# Altium project Olimex interface board.PrjPcb
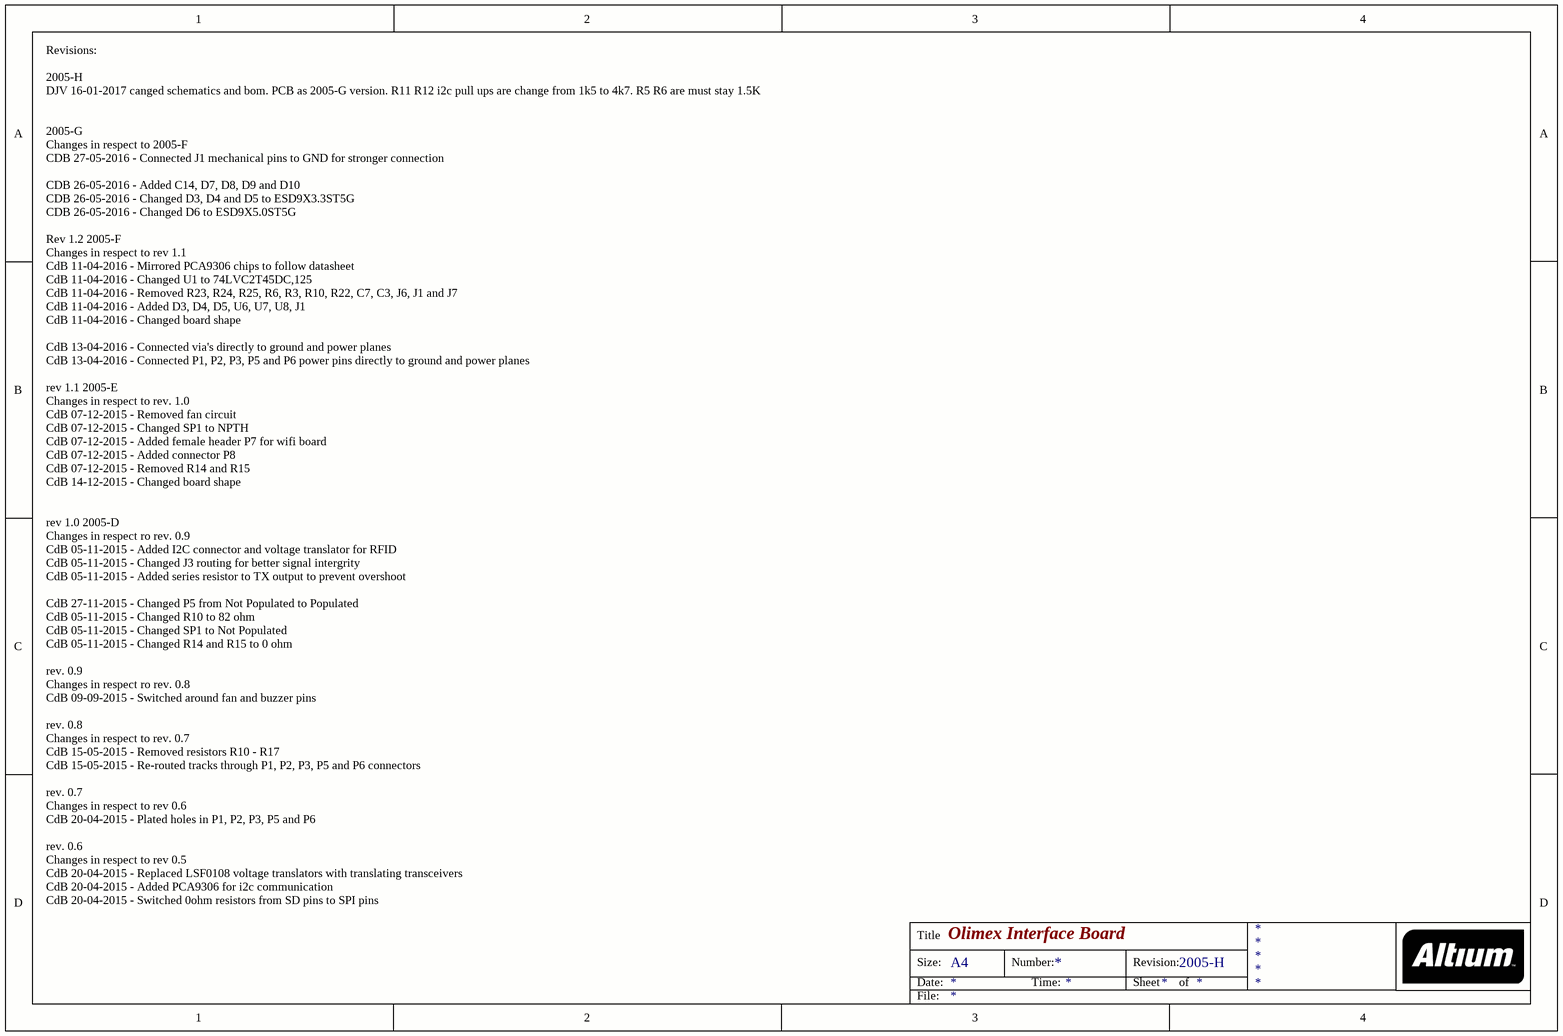
[diagram p0: Revisions.SchDoc]
3 sheets, 92 parts. Net scope: flat (ports and power ports of the same name join across sheets).
Board file: Olimex interface board.PcbDoc
Sheets:
  Revisions.SchDoc
  Schema1.SchDoc
  Schema2.SchDoc

## Sheet Revisions.SchDoc: Olimex Interface Board
size A4; CompanyName: Ultimaker B.V.; DrawnBy: Coen de Boer; Engineer: Coen de Boer; Revision: 2005-H

### Notes on the sheet
- Revisions:
  2005-H
  DJV 16-01-2017 canged schematics and bom. PCB as 2005-G version. R11 R12 i2c pull ups are change from 1k5 to 4k7. R5 R6 are must stay 1.5K
  2005-G
  Changes in respect to 2005-F
  CDB 27-05-2016 - Connected J1 mechanical pins to GND for stronger connection
  CDB 26-05-2016 - Added C14, D7, D8, D9 and D10
  CDB 26-05-2016 - Changed D3, D4 and D5 to ESD9X3.3ST5G
  CDB 26-05-2016 - Changed D6 to ESD9X5.0ST5G
  Rev 1.2 2005-F
  Changes in respect to rev 1.1
  CdB 11-04-2016 - Mirrored PCA9306 chips to follow datasheet
  CdB 11-04-2016 - Changed U1 to 74LVC2T45DC,125
  CdB 11-04-2016 - Removed R23, R24, R25, R6, R3, R10, R22, C7, C3, J6, J1 and J7
  CdB 11-04-2016 - Added D3, D4, D5, U6, U7, U8, J1
  CdB 11-04-2016 - Changed board shape
  CdB 13-04-2016 - Connected via's directly to ground and power planes
  CdB 13-04-2016 - Connected P1, P2, P3, P5 and P6 power pins directly to ground and power planes
  rev 1.1 2005-E
  Changes in respect to rev. 1.0
  CdB 07-12-2015 - Removed fan circuit
  CdB 07-12-2015 - Changed SP1 to NPTH
  CdB 07-12-2015 - Added female header P7 for wifi board
  CdB 07-12-2015 - Added connector P8
  CdB 07-12-2015 - Removed R14 and R15
  CdB 14-12-2015 - Changed board shape
  rev 1.0 2005-D
  Changes in respect ro rev. 0.9
  CdB 05-11-2015 - Added I2C connector and voltage translator for RFID
  CdB 05-11-2015 - Changed J3 routing for better signal intergrity
  CdB 05-11-2015 - Added series resistor to TX output to prevent overshoot
  CdB 27-11-2015 - Changed P5 from Not Populated to Populated
  CdB 05-11-2015 - Changed R10 to 82 ohm
  CdB 05-11-2015 - Changed SP1 to Not Populated
  CdB 05-11-2015 - Changed R14 and R15 to 0 ohm
  rev. 0.9
  Changes in respect ro rev. 0.8
  CdB 09-09-2015 - Switched around fan and buzzer pins
  rev. 0.8
  Changes in respect to rev. 0.7
  CdB 15-05-2015 - Removed resistors R10 - R17
  CdB 15-05-2015 - Re-routed tracks through P1, P2, P3, P5 and P6 connectors
  rev. 0.7
  Changes in respect to rev 0.6
  CdB 20-04-2015 - Plated holes in P1, P2, P3, P5 and P6
  rev. 0.6
  Changes in respect to rev 0.5
  CdB 20-04-2015 - Replaced LSF0108 voltage translators with translating transceivers
  CdB 20-04-2015 - Added PCA9306 for i2c communication
  CdB 20-04-2015 - Switched 0ohm resistors from SD pins to SPI pins
  CdB 20-04-2015 - Added resistors in series to non used pins to Ulticontroller
  CdB 20-04-2015 - Moved SD-card detect to interrupt pin
- Title
- Size:
- Date:
- A4
- Number:
- Time:
- Revision:
- Sheet
- of
- File:

## Sheet Schema1.SchDoc: Olimex interface board
size A4; DrawnBy: Coen de Boer; Engineer: Coen de Boer; Revision: 2005-H; SheetNumber: 1
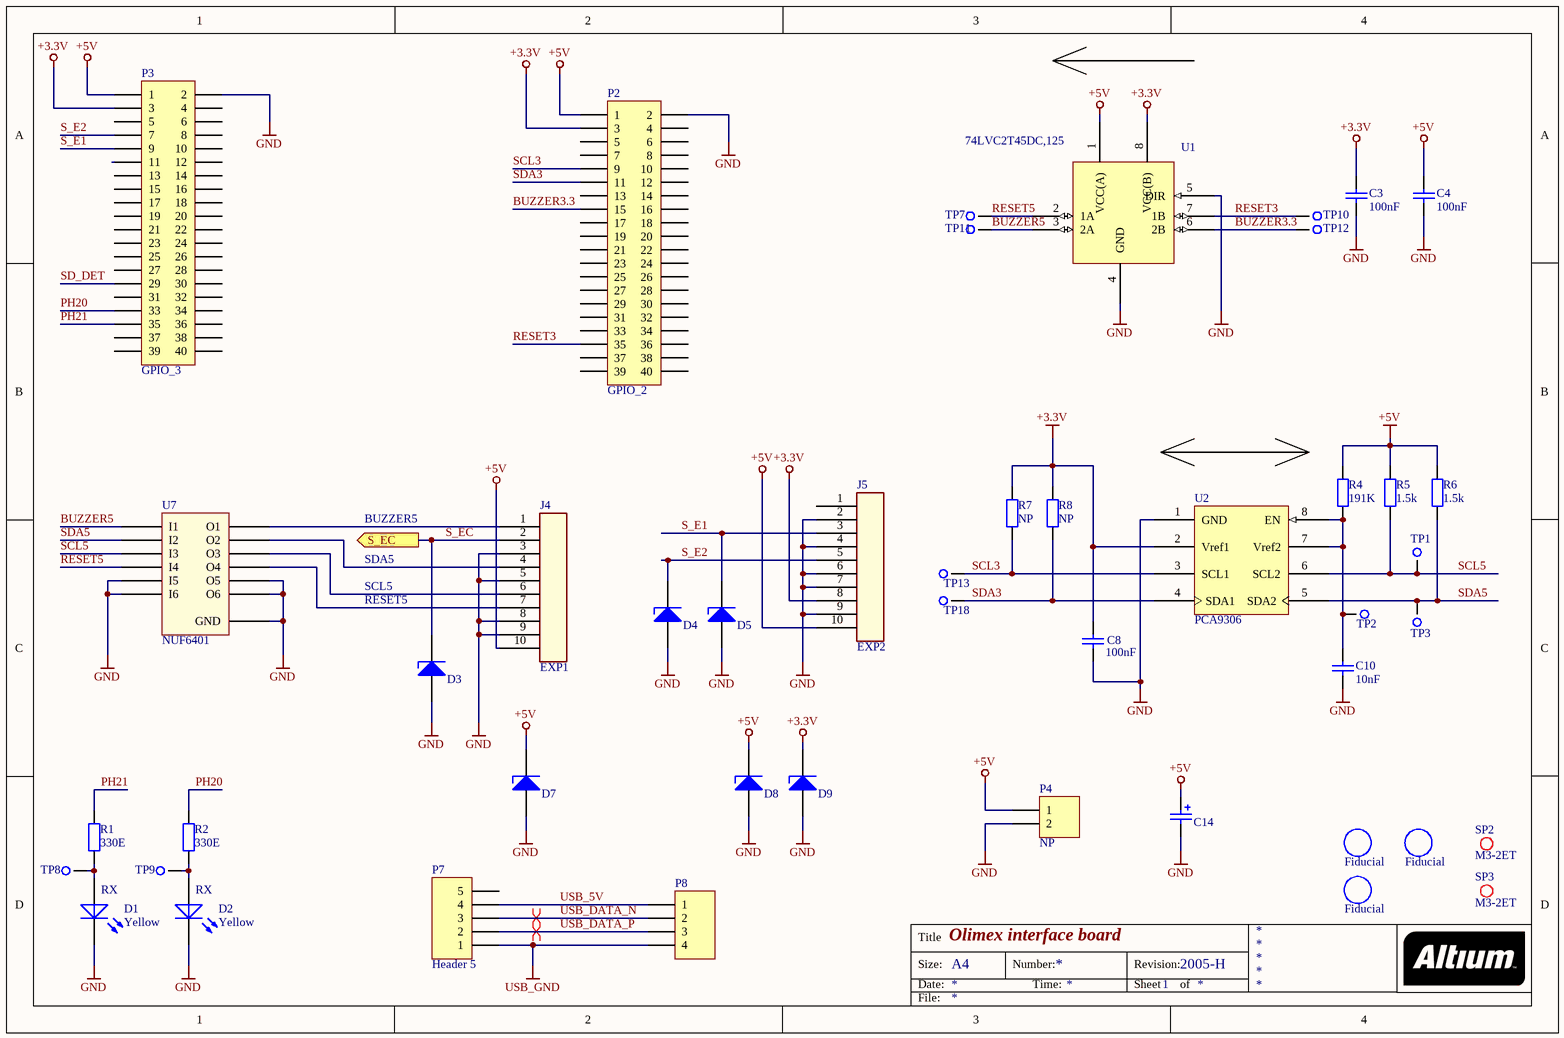
[diagram p1: Schema1.SchDoc]

### Parts
C3  100nF  [C0805 (2012)]
C4  100nF  [C0805 (2012)]
C8  100nF  [C0805 (2012)]
C10  10nF  [C0805 (2012)]
C14  470u  [CAPAE7866X80M]  (value not drawn)
D1  Yellow  [LED0805-YELLOW]
D2  Yellow  [LED0805-YELLOW]
D3  ESD9X3.3ST5G  [SODFL100X40-2N]  (value not drawn)
D4  ESD9X3.3ST5G  [SODFL100X40-2N]  (value not drawn)
D5  ESD9X3.3ST5G  [SODFL100X40-2N]  (value not drawn)
D7  ESD9X5.0ST5G  [SODFL100X40-2N]  (value not drawn)
D8  ESD9X5.0ST5G  [SODFL100X40-2N]  (value not drawn)
D9  ESD9X3.3ST5G  [SODFL100X40-2N]  (value not drawn)
Fid1  Fiducial  [Fiducial 1,5mm]  (no BOM)
Fid2  Fiducial  [Fiducial 1,5mm]  (no BOM)
Fid3  Fiducial  [Fiducial 1,5mm]  (no BOM)
J4  EXP1  [BOXHEADER-10P-R/A-ST-2.54]
J5  EXP2  [BOXHEADER-10P-R/A-ST-2.54]
P2  GPIO_2  [M50-3152042]
P3  GPIO_3  [M50-3152042]
P4  NP  [HDR1X2]
P7  Header 5  [Female Header 5 pins]
P8  (no value)  [B4B-XH-A]
R1  330E  [RESC1608X05N]
R2  330E  [RESC1608X05N]
R4  191K  [R0805 (2012)]
R5  1.5k  [RESC1608X05N]
R6  1.5k  [RESC1608X05N]
R7  NP  [R0805 (2012)]
R8  NP  [R0805 (2012)]
SP2  M3-2ET  [SPACER M3-4ET]
SP3  M3-2ET  [Spacer M3-4ETkleinepad]
TP1  2mm  [TESTPOINT 2mm]  (value not drawn)  (no BOM)
TP2  2mm  [TESTPOINT 2mm]  (value not drawn)  (no BOM)
TP3  2mm  [TESTPOINT 2mm]  (value not drawn)  (no BOM)
TP7  2mm  [TESTPOINT 2mm]  (value not drawn)  (no BOM)
TP8  2mm  [TESTPOINT 2mm]  (value not drawn)  (no BOM)
TP9  2mm  [TESTPOINT 2mm]  (value not drawn)  (no BOM)
TP10  2mm  [TESTPOINT 2mm]  (value not drawn)  (no BOM)
TP11  2mm  [TESTPOINT 2mm]  (value not drawn)  (no BOM)
TP12  2mm  [TESTPOINT 2mm]  (value not drawn)  (no BOM)
TP13  2mm  [TESTPOINT 2mm]  (value not drawn)  (no BOM)
TP18  2mm  [TESTPOINT 2mm]  (value not drawn)  (no BOM)
U1  74LVC2T45DC,125  [TSSOP50P310X100-8N]
U2  PCA9306  [IC SSOP-8]
U7  NUF6401  [SON50P140X100_HS-13N]

### Ports
S_EC (out)

### Nets
+3.3V: C3.1 C8.2 D9.1(K) J5.8 P2.3 P3.3 R7.2 R8.2 U1.8(VCC(B)) U2.2(Vref1)
+5V: C4.1 C14.1 D7.1(K) D8.1(K) J4.10 J5.10 P2.1 P3.1 P4.1 R4.2 R5.2 R6.2 U1.1(VCC(A))
GND: C3.2 C4.2 C8.1 C10.1 C14.2 D1.2(K) D2.2(K) D3.2(A) D4.2(A) D5.2(A) D7.2(A) D8.2(A) D9.2(A) J4.3 J4.5 J4.8 J4.9 J5.2 J5.4 J5.6 J5.7 J5.9 P2.2 P3.2 P4.2 U1.4(GND) U1.5(DIR) U2.1(GND) U7.5(I5) U7.6(I6) U7.7(O6) U7.8(O5) U7.13(GND)
USB_GND: P7.1 P8.4
BUZZER3.3: P2.15 TP12.1 U1.6(2B)
BUZZER5: TP11.1 U1.3(2A) U7.1(I1)
PH20: P3.33 R2.2
PH21: P3.35 R1.2
RESET3: P2.35 TP10.1 U1.7(1B)
RESET5: TP7.1 U1.2(1A) U7.4(I4)
S_E1: D5.1(K) J5.3 P3.9
S_E2: D4.1(K) J5.5 P3.7
S_EC: D3.1(K) J4.2 ; port S_EC
SCL3: P2.9 R7.1 TP13.1 U2.3(SCL1)
SCL5: R5.1 TP1.1 U2.6(SCL2) U7.3(I3)
SD_DET: P3.29
SDA3: P2.11 R8.1 TP18.1 U2.4(SDA1)
SDA5: R6.1 TP3.1 U2.5(SDA2) U7.2(I2)
USB_5V: P7.4 P8.1
USB_DATA_N: P7.3 P8.2
USB_DATA_P: P7.2 P8.3
NetC10_2: C10.2 R4.1 TP2.1 U2.7(Vref2) U2.8(EN)
NetD1_1: D1.1(A) R1.1 TP8.1
NetD2_1: D2.1(A) R2.1 TP9.1
NetJ4_1: J4.1 U7.12(O1)
NetJ4_4: J4.4 U7.11(O2)
NetJ4_6: J4.6 U7.10(O3)
NetJ4_7: J4.7 U7.9(O4)

Not connected (* = marked no-connect by the designer): J5 1; P2 4 5 6 7 8 10 12 13 14 16 17 18 19 20 21 22 23 24 25 26 27 28 29 30 31 32 33 34 36 37 38 39 40; P3 4 5 6 8 10 11 12 13 14 15 16 17 18 19 20 21 22 23 24 25 26 27 28 30 31 32 34 36 37 38 39 40; P7 5

### Layout directives
differential pair: USB_DATA_N, USB_DATA_P

### Notes on the sheet
- BUZZER5
- SDA5
- SCL5
- RESET5
- (near D1) RX
- (near D2) RX
- Title
- Size:
- Date:
- A4
- Number:
- Time:
- Revision:
- Sheet
- of
- File:

### Library data of the parts
C3 C4 C8 = Cap 100nF X7R 0805: Cap 100nF X7R 0805 10% 100V; Mfg: AVX; Mfg code: 08051C104K4T2A; Faber ItemCode: -; Max soldering temp: -; Remarks: -; Supplier: Farnell; Supplier code: 1833888; Value: 100nF; SMD: Yes
C10 = Cap 10nF X7R 0805: Cap 10nF X7R 0805 10% 100V; Mfg: AVX; Mfg code: 08051C103K4Z2A; Faber ItemCode: -; Max soldering temp: -; Remarks: -; Supplier: Farnell; Supplier code: 1833850; SMD: Yes; Value: 10nF
C14 = CAP ALUM 470UF 20% 10V SMD: Mfg: Panasonic Electronic Components; Mfg code: EEE-FTA471XAP; Capacitance: 470µF; ESR (Equivalent Series Resistance): 160 mohm @ 100kHz; Lifetime @ Temp.: 2000 Hrs @ 105°C; Polarization: Polar; Ripple Current: 390mA @ 120Hz; Surface Mount Land Size: 0.260" L x 0.260" W (6.60mm x 6.60mm); Supplier 1: Digi-Key; Supplier Part Number 1: P15094TR-ND; RoHS: RoHS Compliant; Category: Capacitors; Stock: 31500; Pricing: 900=0.22154, 1800=0.20851, 2700=0.19548, 4500=0.18244, 9000=0.17593, 22500=0.17332, 45000=0.16941, 90000=0.16615 (EUR); Packaging: Tape & Reel (TR); Tolerance: ±20%; Voltage Rating: 10V; Operating Temperature: -55°C ~ 105°C; Applications: General Purpose; Impedance: -; Lead Spacing: -; Size / Dimension: 0.248" Dia (6.30mm); Height - Seated (Max): 0.315" (8.00mm); Mounting Type: Surface Mount; Package / Case: Radial, Can - SMD; ComponentLink1URL: http://industrial.panasonic.com/cdbs/www-data/pdf/RDE0000/ABA0000C35.pdf; ComponentLink1Description: http://industrial.panasonic.com/cdbs/www-data/pdf/RDE0000/ABA0000C35.pdf
D1 D2 = Library_LED-0003: RO LED GEEL HSMY-C170 0805  AVAGO; Faber ItemCode: 35160800; ID: Library_LED-0003; Mfg: AVAGO; Mfg code: HSMY-C170; Value: Yellow
D3-D5 D9 = ESD9X3.3ST5G: TVS DIODE 3.3VWM 10.4VC SOD923; Mfg: ON Semiconductor; Type: Zener; Unidirectional Channels: 1; Voltage - Reverse Standoff (Typ): 3.3V (Max); Voltage - Breakdown (Min): 5V; Voltage - Clamping (Max) @ Ipp: 10.4V; Current - Peak Pulse (10/1000µs): 9.8A (8/20µs); Power - Peak Pulse: 102W; Power Line Protection: No; Capacitance @ Frequency: 80pF @ 1MHz; Supplier 1: Digi-Key; Supplier Part Number 1: ESD9X3.3ST5GOSTR-ND; Mfg code: ESD9X3.3ST5G; RoHS: RoHS Compliant; Category: Circuit Protection; Stock: 136000; Pricing: 8000=0.03287, 16000=0.02794, 24000=0.02629, 56000=0.02465, 200000=0.02136 (EUR); Packaging: Tape & Reel (TR); Bidirectional Channels: -; Applications: Automotive; Operating Temperature: -55°C ~ 150°C (TJ); Mounting Type: Surface Mount; Package / Case: SOD-923; Supplier Device Package: SOD-923; ComponentLink1URL: http://www.onsemi.com/pub_link/Collateral/ESD9X3.3ST5G-D.PDF; ComponentLink1Description: http://www.onsemi.com/pub_link/Collateral/ESD9X3.3ST5G-D.PDF
D7 D8 = ESD9X5.0ST5G: TVS DIODE 5VWM 12.3VC SOD923; Mfg: ON Semiconductor; Type: Zener; Unidirectional Channels: 1; Voltage - Reverse Standoff (Typ): 5V (Max); Voltage - Breakdown (Min): 6.2V; Voltage - Clamping (Max) @ Ipp: 12.3V; Current - Peak Pulse (10/1000µs): 8.7A (8/20µs); Power - Peak Pulse: 107W; Power Line Protection: No; Capacitance @ Frequency: 65pF @ 1MHz; Supplier 1: Digi-Key; Supplier Part Number 1: ESD9X5.0ST5GOSTR-ND; Mfg code: ESD9X5.0ST5G; RoHS: RoHS Compliant; Category: Circuit Protection; Stock: 40000; Pricing: 8000=0.02337, 16000=0.02032, 24000=0.01829, 56000=0.01626, 200000=0.01351 (EUR); Packaging: Tape & Reel (TR); Bidirectional Channels: -; Applications: General Purpose; Operating Temperature: -55°C ~ 150°C (TJ); Mounting Type: Surface Mount; Package / Case: SOD-923; Supplier Device Package: SOD-923; ComponentLink1URL: http://www.onsemi.com/pub_link/Collateral/ESD9X3.3ST5G-D.PDF; ComponentLink1Description: http://www.onsemi.com/pub_link/Collateral/ESD9X3.3ST5G-D.PDF
Fid1-Fid3 = Library_MISC-0003: ID: Library_MISC-0003; Faber ItemCode: -; Mfg: -; Mfg code: -; Value: Fiducial
J4 J5 = Library_CON-0019: RO CONN PR HDR BOX 10p HKS 61201021721 WUERTH; Value: BOXHEADER-10P-R/A-ST-2.54; Faber ItemCode: 36925800; ID: Library_CON-0019
P2 P3 = MHDR2X20: HARWIN - M50-3152042 - SOCKET, DUAL ENTRY, SMT, 40WAY; LatestRevisionDate: 17-Jul-2002; LatestRevisionNote: Re-released for DXP Platform.; Publisher: Altium Limited; Farnell code:: 1189109; Mfg: Harwin; Mfg code: M50-3152042; Supplier: Farnell; Supplier code: 1189109
P4 = Header 2: LatestRevisionDate: 17-Jul-2002; LatestRevisionNote: Re-released for DXP Platform.; Publisher: Altium Limited
P7 = Header 5: Header, 5-Pin; Mfg: Multicomp; Mfg code: 2212S-05SG-85
P8 = Header 4: Header, 4-Pin; Mfg: JST (JAPAN SOLDERLESS TERMINALS); Mfg code: B4B-XH-A (LF)(SN); LatestRevisionDate: 17-Jul-2002; LatestRevisionNote: Re-released for DXP Platform.; Publisher: Altium Limited; Farnell code: 1516278
R1 R2 = 330E/0603: RES 330 OHM 1/10W 1% 0603 SMD; Manufacturer: Vishay Dale; Manufacturer Part Number: CRCW0603330RFKEA; VALUE: 10; Resistance (Ohms): 330; Power (Watts): 0.1W, 1/10W; Temperature Coefficient: ±100ppm/°C; Supplier 1: Digi-Key; Supplier Part Number 1: 541-330HDKR-ND; RoHS: RoHS Compliant; Category: Resistors; Stock 1: 34990; Pricing 1: 10=0.069, 50=0.037, 200=0.02135, 1000=0.01454 (EUR); Composition: Thick Film; Features: Automotive AEC-Q200 Qualified; Tolerance: ±1%; Package / Case: 0603 (1608 Metric); Supplier Device Package: 0603 (1608 Metric); Size / Dimension: 0.061" L x 0.033" W (1.55mm x 0.85mm); Height: 0.020" (0.50mm); Number of Terminations: 2; Packaging: Digi-Reel®; ComponentLink1URL: http://www.vishay.com/doc?20035; ComponentLink1Description: http://www.vishay.com/doc?20035; Mfg: Vishay Dale; Mfg code: CRCW0603330RFKEA; Supplier: Farnell; Supplier code: 2122302
R4 = Res 191K 0805: Res 191K 0805 1% 125mW; Mfg: VISHAY DRALORIC; Mfg code: CRCW0805191KFKEA; Faber ItemCode: -; Max soldering temp: -; Remarks: -; Supplier: Farnell; Supplier code: 2139049; Value: 191K; SMD: Yes
R5 R6 = 47k/0603: RES SMD 1.5K OHM 1% 1/10W 0603; Manufacturer: Vishay Dale; Manufacturer Part Number: CRCW06031K50FKEA; Power (Watts): 0.1W, 1/10W; Temperature Coefficient: ±100ppm/°C; Supplier 1: Digi-Key; Supplier Part Number 1: 541-1.50KHDKR-ND; RoHS: RoHS Compliant; Category: Resistors; Stock 1: 104542; Pricing 1: 1=0.1, 10=0.029, 25=0.0212, 50=0.0162, 100=0.0118, 250=0.00904, 500=0.00722, 1000=0.00532 (EUR); Packaging: Digi-Reel®; Part Status: Active; Resistance (Ohms): 1.5k; Tolerance: ±1%; Composition: Thick Film; Features: Automotive AEC-Q200; Operating Temperature: -55°C ~ 155°C; Package / Case: 0603 (1608 Metric); Supplier Device Package: 0603; Size / Dimension: 0.063" L x 0.033" W (1.60mm x 0.85mm); Height - Seated (Max): 0.020" (0.50mm); Number of Terminations: 2; Failure Rate: -; ComponentLink1URL: http://www.vishay.com/docs/20035/dcrcwe3.pdf; ComponentLink1Description: http://www.vishay.com/docs/20035/dcrcwe3.pdf
R7 R8 = Res 4.7K 0805: Res 4.7K 0805 1% 100mW; Mfg: MULTICOMP; Mfg code: MC 0.1W 0805 1% 4K7; Faber ItemCode: -; Max soldering temp: -; Remarks: -; Supplier: Farnell; Supplier code: 9333266; Value: 4.7K; SMD: Yes
SP2 SP3 = Spacer M3-10ET: MOER-SMD SMTSO-M3-2ET  PEM; Mfg: PEM; Mfg code: SMTSO-M3-2ET; Value: -; Remarks: -; Supplier: Onkenhout & Onkenhout; Supplier code: SMTSO-M3-2ET; Max soldering temp: -; SMD: Yes
TP1-TP3 TP7-TP13 TP18 = Testpoint, 2mm, round: Remarks: Not a component; Faber ItemCode: -; Mfg: -; Mfg code: -; Value: -; Supplier: -; Supplier code: -; Max soldering temp: -
U1 = 74LVC2T45DC,125: 2-bit translaing transceiver; Mfg: NXP; Mfg code: 74LVC2T45DC,125; Supplier: Farnell; Supplier code: 2444915
U2 = IC PCA9306: IC PCA9306 Voltage Level translator; Mfg: TEXAS INSTRUMENTS; Mfg code: PCA9306DCTR; Faber ItemCode: -; Max soldering temp: -; Remarks: -; SMD: Yes; Supplier: Farnell; Supplier code: 1470936; Value: -
U7 = NUF6401: Mfg: ON Semiconductor; Mfg code: NUF6401MNT1G; Filter Order: 2nd; Number of Channels: 6; Center / Cutoff Frequency: 110MHz (Cutoff); Attenuation Value: 30dB @ 800MHz ~ 3GHz; Resistance - Channel (Ohms): 100; Values: R = 100 Ohms, C = 17pF; ESD Protection: Yes; Supplier 1: Digi-Key; Supplier Part Number 1: NUF6401MNT1GOSTR-ND; RoHS: RoHS Compliant; Category: Filters; Stock: 6000; Pricing: 3000=0.13931, 6000=0.13111, 15000=0.12292, 30000=0.11472 (EUR); Packaging: Tape & Reel (TR); Type: Low Pass; Technology: RC (Pi); Current: -; Operating Temperature: -40°C ~ 85°C; Applications: Data Lines for Mobile Devices; Package / Case: 12-VFDFN Exposed Pad; Size / Dimension: 0.118" L x 0.053" W (3.00mm x 1.35mm); Height: 0.039" (1.00mm); ComponentLink1URL: http://www.onsemi.cn/pub_link/Collateral/NUF6401-D.PDF; ComponentLink1Description: http://www.onsemi.cn/pub_link/Collateral/NUF6401-D.PDF

## Sheet Schema2.SchDoc: Olimex Interface Board
size A4; DrawnBy: Coen de Boer; Engineer: Coen de Boer; Revision: 2005-H
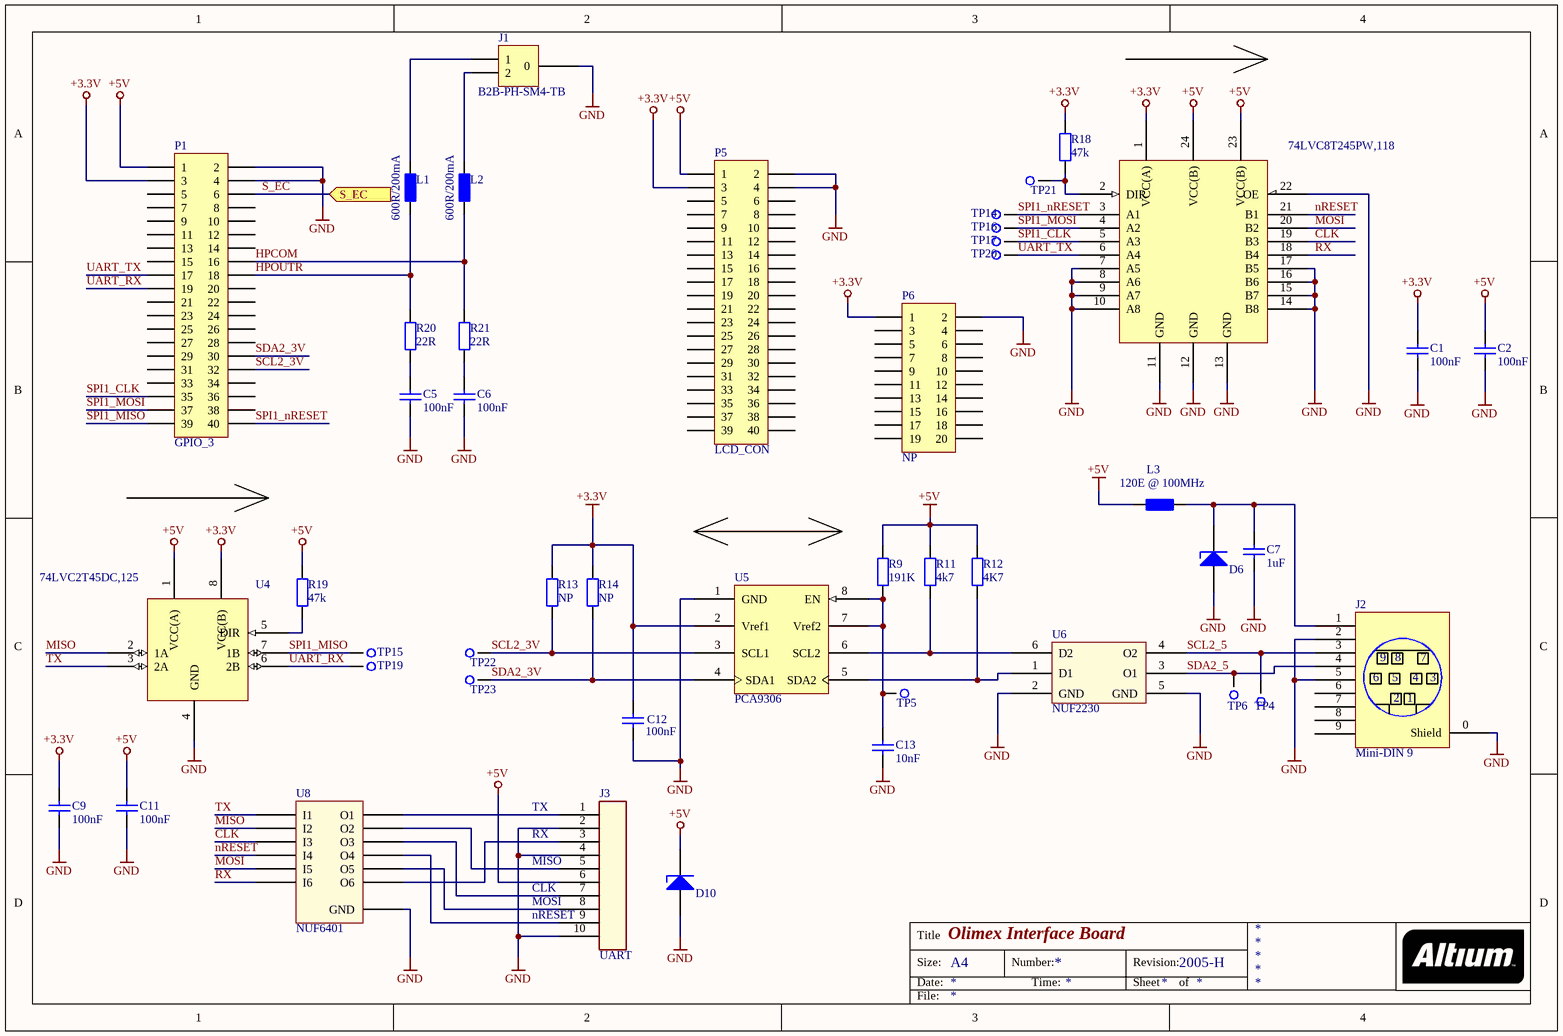
[diagram p2: Schema2.SchDoc]

### Parts
C1  100nF  [C0805 (2012)]
C2  100nF  [C0805 (2012)]
C5  100nF  [C0805 (2012)]
C6  100nF  [C0805 (2012)]
C7  1uF  [CAPC1608X09N]
C9  100nF  [C0805 (2012)]
C11  100nF  [C0805 (2012)]
C12  100nF  [C0805 (2012)]
C13  10nF  [C0805 (2012)]
D6  ESD9X5.0ST5G  [SODFL100X40-2N]  (value not drawn)
D10  ESD9X5.0ST5G  [SODFL100X40-2N]  (value not drawn)
J1  B2B-PH-SM4-TB  [B2B-PH-SM4-TB]
J2  Mini-DIN 9  [MD-90SM]
J3  UART  [BOXHEADER-10P-straight]
L1  600R/200mA  [R0805]
L2  600R/200mA  [R0805]
L3  120E @ 100MHz  [R0603]
P1  GPIO_3  [M50-3152042]
P5  LCD_CON  [M50-3152042]
P6  NP  [HARWIN M20]
R9  191K  [R0805 (2012)]
R11  4k7  [RESC1608X05N]
R12  4K7  [RESC1608X05N]
R13  NP  [R0805 (2012)]
R14  NP  [R0805 (2012)]
R18  47k  [RESC1608X05N]
R19  47k  [RESC1608X05N]
R20  22R  [RESC1608X05N]
R21  22R  [RESC1608X05N]
TP4  2mm  [TESTPOINT 2mm]  (value not drawn)  (no BOM)
TP5  2mm  [TESTPOINT 2mm]  (value not drawn)  (no BOM)
TP6  2mm  [TESTPOINT 2mm]  (value not drawn)  (no BOM)
TP14  2mm  [TESTPOINT 2mm]  (value not drawn)  (no BOM)
TP15  2mm  [TESTPOINT 2mm]  (value not drawn)  (no BOM)
TP16  2mm  [TESTPOINT 2mm]  (value not drawn)  (no BOM)
TP17  2mm  [TESTPOINT 2mm]  (value not drawn)  (no BOM)
TP19  2mm  [TESTPOINT 2mm]  (value not drawn)  (no BOM)
TP20  2mm  [TESTPOINT 2mm]  (value not drawn)  (no BOM)
TP21  2mm  [TESTPOINT 2mm]  (value not drawn)  (no BOM)
TP22  2mm  [TESTPOINT 2mm]  (value not drawn)  (no BOM)
TP23  2mm  [TESTPOINT 2mm]  (value not drawn)  (no BOM)
U3  74LVC8T245PW,118  [TSOP65P640X110-24N]
U4  74LVC2T45DC,125  [TSSOP50P310X100-8N]
U5  PCA9306  [IC SSOP-8]
U6  NUF2230  [SOTFL50P160X60-6N]
U8  NUF6401  [SON50P140X100_HS-13N]

### Ports
S_EC (in)

### Nets
+3.3V: C1.1 C9.1 C12.2 P1.3 P5.3 P6.1 R13.2 R14.2 R18.1 U3.1(VCC(A)) U4.8(VCC(B)) U5.2(Vref1)
+5V: C2.1 C11.1 D10.1(K) J3.6 L3.1 P1.1 P5.1 R9.2 R11.2 R12.2 R19.1 U3.23(VCC(B)) U3.24(VCC(B)) U4.1(VCC(A))
GND: C1.2 C2.2 C5.2 C6.2 C7.1 C9.2 C11.2 C12.1 C13.1 D6.2(A) D10.2(A) J1.0 J2.0(Shield) J2.2 J2.5 J3.2 J3.4 J3.10 P1.2 P1.4 P5.2 P5.4 P6.2 U3.7(A5) U3.8(A6) U3.9(A7) U3.10(A8) U3.11(GND) U3.12(GND) U3.13(GND) U3.14(B8) U3.15(B7) U3.16(B6) U3.17(B5) U3.22(OE) U4.4(GND) U5.1(GND) U6.2(GND) U6.5(GND) U8.13(GND)
CLK: U3.19(B3) U8.3(I3)
HPCOM: L2.1 P1.16 R21.2
HPOUTR: L1.1 P1.18 R20.2
MISO: U4.2(1A) U8.2(I2)
MOSI: U3.20(B2) U8.5(I5)
nRESET: U3.21(B1) U8.4(I4)
RX: U3.18(B4) U8.6(I6)
S_EC: P1.6 ; port S_EC
SCL2_3V: P1.32 R13.1 TP22.1 U5.3(SCL1)
SCL2_5: J2.3 TP4.1 U6.4(O2)
SDA2_3V: P1.30 R14.1 TP23.1 U5.4(SDA1)
SDA2_5: J2.4 TP6.1 U6.3(O1)
SPI1_CLK: P1.35 TP17.1 U3.5(A3)
SPI1_MISO: P1.39 TP15.1 U4.7(1B)
SPI1_MOSI: P1.37 TP16.1 U3.4(A2)
SPI1_nRESET: P1.40 TP14.1 U3.3(A1)
TX: U4.3(2A) U8.1(I1)
UART_RX: P1.19 TP19.1 U4.6(2B)
UART_TX: P1.17 TP20.1 U3.6(A4)
NetC5_1: C5.1 R20.1
NetC6_1: C6.1 R21.1
NetC7_2: C7.2 D6.1(K) J2.1 L3.2
NetC13_2: C13.2 R9.1 TP5.1 U5.7(Vref2) U5.8(EN)
NetJ1_1: J1.1 L1.2
NetJ1_2: J1.2 L2.2
NetJ3_1: J3.1 U8.12(O1)
NetJ3_3: J3.3 U8.7(O6)
NetJ3_5: J3.5 U8.11(O2)
NetJ3_7: J3.7 U8.10(O3)
NetJ3_8: J3.8 U8.8(O5)
NetJ3_9: J3.9 U8.9(O4)
NetR11_1: R11.1 U5.6(SCL2) U6.6(D2)
NetR12_1: R12.1 U5.5(SDA2) U6.1(D1)
NetR18_2: R18.2 TP21.1 U3.2(DIR)
NetR19_2: R19.2 U4.5(DIR)

Not connected (* = marked no-connect by the designer): J2 6 7 8 9; P1 5 7 8 9 10 11 12 13 14 15 20 21 22 23 24 25 26 27 28 29 31 33 34 36 38; P5 5 6 7 8 9 10 11 12 13 14 15 16 17 18 19 20 21 22 23 24 25 26 27 28 29 30 31 32 33 34 35 36 37 38 39 40; P6 3 4 5 6 7 8 9 10 11 12 13 14 15 16 17 18 19 20

### Notes on the sheet
- RX
- TX
- (near J3) MISO
- (near J3) CLK
- (near J3) MOSI
- (near J3) nRESET
- Title
- Size:
- Date:
- A4
- Number:
- Time:
- Revision:
- Sheet
- of
- File:

### Library data of the parts
C1 C2 C5 C6 C9 C11 C12 = Cap 100nF X7R 0805: as C3 on sheet Schema1; Faber ItemCode: -; Max soldering temp: -; Remarks: -; Supplier: Farnell; Supplier code: 1833888; Value: 100nF; SMD: Yes
C7 = 1uF/10V/0603: CAP CER 1UF 10V 10% X5R 0603; Manufacturer: Murata Electronics North America; Manufacturer Part Number: GRM188R61A105KA61D; Capacitance: 1.0µF; Value: 1uF; Voltage - Rated: 10V; Supplier 1: Digi-Key; Supplier Part Number 1: 490-1543-6-ND; RoHS: RoHS Compliant; Category: Capacitors; Stock 1: 649155; Pricing 1: 1=0.15, 10=0.063, 50=0.0344, 100=0.0291, 250=0.02372, 500=0.02032, 1000=0.01583 (EUR); Tolerance: ±10%; Temperature Coefficient: X5R; Mounting Type: Surface Mount, MLCC; Operating Temperature: -55°C ~ 85°C; Applications: General Purpose; Ratings: -; Package / Case: 0603 (1608 Metric); Size / Dimension: 0.063" L x 0.031" W (1.60mm x 0.80mm); Height - Seated (Max): -; Thickness (Max): 0.035" (0.90mm); Lead Spacing: -; Features: -; Packaging: Digi-Reel®; Lead Style: -; ComponentLink1URL: http://psearch.murata.com/capacitor/product/GRM188R61A105KA61#.pdf; ComponentLink1Description: http://psearch.murata.com/capacitor/product/GRM188R61A105KA61#.pdf; Mfg: Murata Electronics North America; Mfg code: GRM188R61A105KA61D
C13 = Cap 10nF X7R 0805: as C10 on sheet Schema1; Faber ItemCode: -; Max soldering temp: -; Remarks: -; Supplier: Farnell; Supplier code: 1833850; SMD: Yes; Value: 10nF
D6 D10 = ESD9X5.0ST5G: as D7 on sheet Schema1; Supplier 1: Digi-Key; Supplier Part Number 1: ESD9X5.0ST5GOSTR-ND; Mfg code: ESD9X5.0ST5G; RoHS: RoHS Compliant; Category: Circuit Protection; Stock: 40000; Pricing: 8000=0.02337, 16000=0.02032, 24000=0.01829, 56000=0.01626, 200000=0.01351 (EUR); Packaging: Tape & Reel (TR); Bidirectional Channels: -; Applications: General Purpose; Operating Temperature: -55°C ~ 150°C (TJ); Mounting Type: Surface Mount; Package / Case: SOD-923; Supplier Device Package: SOD-923; ComponentLink1URL: http://www.onsemi.com/pub_link/Collateral/ESD9X3.3ST5G-D.PDF; ComponentLink1Description: http://www.onsemi.com/pub_link/Collateral/ESD9X3.3ST5G-D.PDF
J1 = Header 2_1: JST B2B-PH-SM4-TB; Mfg: JST; Mfg code: B2B-PH-SM4-TB; Manufacturer: JST; Manufacturer Part Number: B2B-PH-SM4-TB
J2 = Mini-DIN 9: Mfg: CUI Inc.; Connector Type: Receptacle, Female Sockets; Number of Positions: 9; Current Rating: 1A, 2A; Voltage - Rated: 100VAC, 12VDC; Supplier 1: Digi-Key; Supplier Part Number 1: CP-2290-ND; Mfg code: MD-90SM; RoHS: RoHS Compliant; Category: Connectors, Interconnects; Stock: 370; Pricing: 1=1.81, 10=1.505, 100=1.1146, 500=0.89166, 1000=0.80808 (EUR); Packaging: Bulk; Shell Size - Insert: Mini DIN; Shell Size, MIL: -; Mounting Type: Through Hole, Right Angle; Termination: Solder; Fastening Type: Push-Pull; Orientation: Keyed; Ingress Protection: -; Shell Material, Finish: Polybutylene Terephthalate (PBT); Contact Finish: Silver; Features: Shielded; Contact Finish Thickness: -; Operating Temperature: -40°C ~ 85°C; ComponentLink1URL: http://www.cui.com/product/resource/digikeypdf/md-xxsm_series.pdf; ComponentLink1Description: http://www.cui.com/product/resource/digikeypdf/md-xxsm_series.pdf
J3 = Library_CON-0019: RO CONN PR HDR BOX 10p; Mfg: Wurth; Mfg code: 61201021621; Supplier: Farnell; Supplier code: 1642019
L1 L2 = Ferriet Bead 600E: Mfg: Fair-rite; Mfg code: 2508056017Y2; Farnell code: 1838838RL; Supplier: Farnell; Supplier code: 1838838RL
L3 = Ferriet Bead 120E: FERRIET BLM18PG121SN1D 0603 MURATA; Info: Resistor; ID: -; Faber ItemCode: -; Value: 120E @ 100MHz; Mfg: Murata; Mfg code: BLM18PG121SN1D
P1 P5 = MHDR2X20: as P2 on sheet Schema1; LatestRevisionDate: 17-Jul-2002; LatestRevisionNote: Re-released for DXP Platform.; Publisher: Altium Limited; Farnell code:: 1189109; Mfg: Harwin; Mfg code: M50-3152042; Supplier: Farnell; Supplier code: 1189109
P6 = MHDR2X10: HARWIN M20; LatestRevisionDate: 17-Jul-2002; LatestRevisionNote: Re-released for DXP Platform.; Publisher: Altium Limited
R9 = Res 191K 0805: as R4 on sheet Schema1; Faber ItemCode: -; Max soldering temp: -; Remarks: -; Supplier: Farnell; Supplier code: 2139049; Value: 191K; SMD: Yes
R11 R12 = Res 4.7K 0805: RES SMD 4.7K OHM 1% 1/10W 0603; Manufacturer: Vishay Dale; Manufacturer Part Number: CRCW06034K70FKEA; Power (Watts): 0.1W, 1/10W; Temperature Coefficient: ±100ppm/°C; Supplier 1: Digi-Key; Supplier Part Number 1: 541-4.70KHDKR-ND; RoHS: RoHS Compliant; Category: Resistors; Stock 1: 396545; Pricing 1: 1=0.1, 10=0.029, 25=0.0212, 50=0.0162, 100=0.0118, 250=0.00904, 500=0.00722, 1000=0.00532 (EUR); Packaging: Digi-Reel®; Part Status: Active; Resistance (Ohms): 4.7k; Tolerance: ±1%; Composition: Thick Film; Features: Automotive AEC-Q200; Operating Temperature: -55°C ~ 155°C; Package / Case: 0603 (1608 Metric); Supplier Device Package: 0603; Size / Dimension: 0.063" L x 0.033" W (1.60mm x 0.85mm); Height - Seated (Max): 0.020" (0.50mm); Number of Terminations: 2; Failure Rate: -; ComponentLink1URL: http://www.vishay.com/docs/20035/dcrcwe3.pdf; ComponentLink1Description: http://www.vishay.com/docs/20035/dcrcwe3.pdf
R13 R14 = Res 4.7K 0805: as R7 on sheet Schema1; Faber ItemCode: -; Max soldering temp: -; Remarks: -; Supplier: Farnell; Supplier code: 9333266; Value: 4.7K; SMD: Yes
R18 R19 = 47k/0603: RES 47.0K OHM 1/10W 1% 0603 SMD; Manufacturer: Vishay Dale; Manufacturer Part Number: CRCW060347K0FKEA; Power (Watts): 0.1W, 1/10W; Temperature Coefficient: ±100ppm/°C; Supplier 1: Digi-Key; RoHS: RoHS Compliant; Category: Resistors; Stock 1: 78114; Pricing 1: 10=0.069, 50=0.037, 200=0.02135, 1000=0.01454 (EUR); Resistance (Ohms): 47k; Composition: Thick Film; Features: Automotive AEC-Q200 Qualified; Tolerance: ±1%; Package / Case: 0603 (1608 Metric); Supplier Device Package: 0603 (1608 Metric); Size / Dimension: 0.061" L x 0.033" W (1.55mm x 0.85mm); Height: 0.020" (0.50mm); Number of Terminations: 2; Packaging: Digi-Reel®; ComponentLink1URL: http://www.vishay.com/doc?20035; ComponentLink1Description: http://www.vishay.com/doc?20035; Supplier Part Number 1: 541-47.0KHDKR-ND; Mfg: Vishay Dale; Mfg code: CRCW060347K0FKEA; Supplier: Farnell; Supplier code: 2122577
R20 R21 = 2.2k/0603: RES 22R OHM 63mW 1% 0603 SMD; Mfg: MULTICOMP; Mfg code: MC0063W0603122R; Supplier: Farnell; Supplier code: 2130723
TP4-TP6 TP14-TP17 TP19-TP23 = Testpoint, 2mm, round: Remarks: Not a component; Faber ItemCode: -; Mfg: -; Mfg code: -; Value: -; Supplier: -; Supplier code: -; Max soldering temp: -
U3 = 74LVC8T245PW,118: 8-bit translaing transceiver; Mfg: NXP; Mfg code: 74LVC8T245PW,118; Supplier: Farnell; Supplier code: 2444917
U4 = 74LVC2T45DC,125: 2-bit translaing transceiver; Mfg: NXP; Mfg code: 74LVC2T45DC,125; Supplier: Farnell; Supplier code: 2444915
U5 = IC PCA9306: as U2 on sheet Schema1; Faber ItemCode: -; Max soldering temp: -; Remarks: -; SMD: Yes; Supplier: Farnell; Supplier code: 1470936; Value: -
U6 = NUF2230: Mfg: ON Semiconductor; Mfg code: NUF2230XV6T1G; Filter Order: 2nd; Number of Channels: 2; Center / Cutoff Frequency: 125MHz (Cutoff); Attenuation Value: 30dB @ 800MHz ~ 900MHz; Resistance - Channel (Ohms): 100; Values: R = 100 Ohms, C = 16pF; ESD Protection: Yes; Supplier 1: Digi-Key; Supplier Part Number 1: NUF2230XV6T1GOSCT-ND; RoHS: RoHS Compliant; Category: Filters; Stock: 3048; Pricing: 1=0.27, 10=0.252, 25=0.2404, 50=0.2326, 100=0.2248, 250=0.21316, 500=0.17828, 1000=0.13836 (EUR); Packaging: Cut Tape (CT); Type: Low Pass; Technology: RC (Pi); Current: -; Operating Temperature: -40°C ~ 85°C; Applications: Data Lines for Mobile Devices; Package / Case: SOT-563, SOT-666; Size / Dimension: 0.063" L x 0.047" W (1.60mm x 1.20mm); Height: 0.024" (0.60mm); ComponentLink1URL: http://www.onsemi.com/pub_link/Collateral/NUF2230XV6-D.PDF; ComponentLink1Description: http://www.onsemi.com/pub_link/Collateral/NUF2230XV6-D.PDF
U8 = NUF6401: as U7 on sheet Schema1; Supplier 1: Digi-Key; Supplier Part Number 1: NUF6401MNT1GOSTR-ND; RoHS: RoHS Compliant; Category: Filters; Stock: 6000; Pricing: 3000=0.13931, 6000=0.13111, 15000=0.12292, 30000=0.11472 (EUR); Packaging: Tape & Reel (TR); Type: Low Pass; Technology: RC (Pi); Current: -; Operating Temperature: -40°C ~ 85°C; Applications: Data Lines for Mobile Devices; Package / Case: 12-VFDFN Exposed Pad; Size / Dimension: 0.118" L x 0.053" W (3.00mm x 1.35mm); Height: 0.039" (1.00mm); ComponentLink1URL: http://www.onsemi.cn/pub_link/Collateral/NUF6401-D.PDF; ComponentLink1Description: http://www.onsemi.cn/pub_link/Collateral/NUF6401-D.PDF

## Nets that join several sheets
+3.3V: Schema1 (10 pins), Schema2 (12 pins)
+5V: Schema1 (13 pins), Schema2 (14 pins)
GND: Schema1 (33 pins), Schema2 (40 pins)
S_EC: Schema1 (D3.1 J4.2), Schema2 (P1.6)